# Altium schematic sheet USB.SchDoc
size A4; SheetNumber: 2; SheetTotal: 7
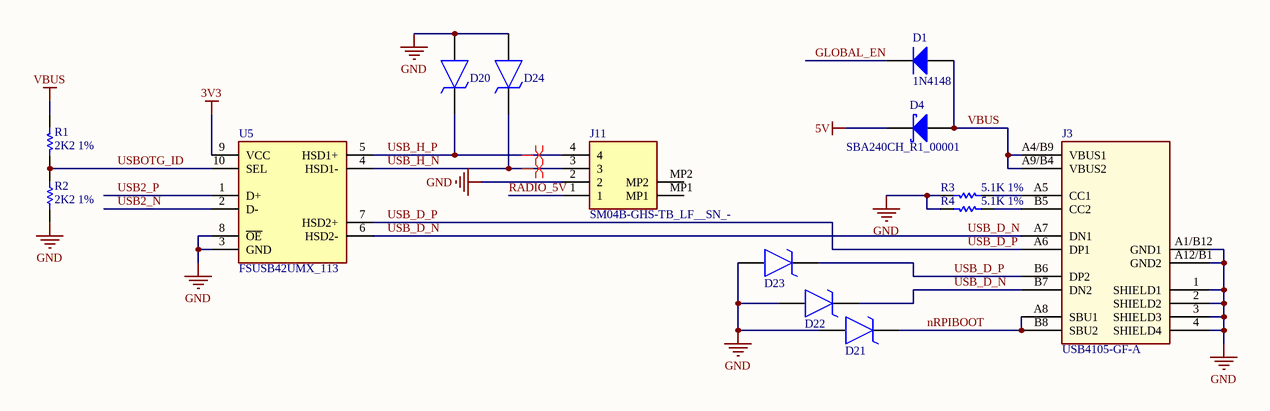
[diagram p0: USB.SchDoc]

## Parts
D1  1N4148  [SODFL1608X70N]
D4  SBA240CH_R1_00001  [SOD-323HE]
D20  ESD351DPYR  [UCLAMP2501TTCT]  (value not drawn)
D21  ESD351DPYR  [UCLAMP2501TTCT]  (value not drawn)
D22  ESD351DPYR  [UCLAMP2501TTCT]  (value not drawn)
D23  ESD351DPYR  [UCLAMP2501TTCT]  (value not drawn)
D24  ESD351DPYR  [UCLAMP2501TTCT]  (value not drawn)
J3  USB4105-GF-A  [GCT_USB4105]
J11  SM04B-GHS-TB_LF__SN_-  [SM04BGHSTBLFSN]
R1  2K2 1%  [0402]
R2  2K2 1%  [0402]
R3  5.1K 1%  [0402]
R4  5.1K 1%  [0402]
U5  FSUSB42UMX_113  [FSUSB42UMX_113]

## Nets
3V3: U5.9(VCC)
5V: D4.1(K)
GND: D20.1(A) D21.1(A) D22.1(A) D23.1(A) D24.1(A) J3.1(SHIELD1) J3.2(SHIELD2) J3.3(SHIELD3) J3.4(SHIELD4) J3.A1/B12(GND1) J3.A12/B1(GND2) J11.2 R2.2 R3.1 R4.1 U5.3(GND) U5.8(~{OE})
VBUS: D1.2(A) D4.2(A) J3.A4/B9(VBUS1) J3.A9/B4(VBUS2) R1.1
GLOBAL_EN: D1.1(K)
nRPIBOOT: D21.2(K) J3.A8(SBU1) J3.B8(SBU2)
RADIO_5V: J11.1
USB2_N: U5.2(D-)
USB2_P: U5.1(D+)
USB_D_N: D22.2(K) J3.A7(DN1) J3.B7(DN2) U5.6(HSD2-)
USB_D_P: D23.2(K) J3.A6(DP1) J3.B6(DP2) U5.7(HSD2+)
USB_H_N: D24.2(K) J11.3 U5.4(HSD1-)
USB_H_P: D20.2(K) J11.4 U5.5(HSD1+)
USBOTG_ID: R1.2 R2.1 U5.10(SEL)
NetJ3_A5: J3.A5(CC1) R3.2
NetJ3_B5: J3.B5(CC2) R4.2

Not connected (* = marked no-connect by the designer): J11 MP1 MP2

## Layout directives
differential pair; differential pair class USB: USB_H_N, USB_H_P

## Library data of the parts
D1 = Diode 1N4148: High Conductance Fast Diode; Manufacturer: Fairchild/ON Semiconductor; Manufacturer Part Number: 1N4148WT; Diode Type: Standard; Voltage - DC Reverse (Vr) (Max): 75V; Current - Average Rectified (Io): 200mA; Voltage - Forward (Vf) (Max) @ If: 1V @ 10mA; Speed: Small Signal =< 200mA (Io), Any Speed; Reverse Recovery Time (trr): 4ns; Current - Reverse Leakage @ Vr: 5µA @ 75V; Capacitance @ Vr, F: 5pF @ 0V, 1MHz; Supplier 1: Digi-Key; RoHS: RoHS Compliant; Category: Discrete Semiconductor Products; Stock 1: 120338; Pricing 1: 1=0.17, 10=0.158, 100=0.0858, 500=0.0528, 1000=0.036 (USD); Packaging: Cut Tape (CT); Part Status: Active; Mounting Type: Surface Mount; Package / Case: SC-79, SOD-523F; Supplier Device Package: SOD-523F; Operating Temperature - Junction: -55°C ~ 150°C; ComponentLink1URL: https://www.fairchildsemi.com/datasheets/1N/1N914BWT.pdf; ComponentLink1Description: https://www.fairchildsemi.com/datasheets/1N/1N914BWT.pdf; Supplier Part Number 1: 1N4148WTCT-ND; MountType: SMT; Height: 0.7mm
D4 = Diode SBA240CH_R1_00001: Diode Schottky 40V 2A SOD323HE; Manufacturer: Pan Jit; Supplier: Digikey; Supplier Part Number: 3757-SBA240CH_R1_00001CT-ND; Manufacturer Part Number: SBA240CH_R1_00001; RoHS: Yes; Category: Uncategorized; Stock: 27422; Pricing: 1=0.29, 10=0.18, 100=0.1122, 500=0.08274, 1000=0.0732, 2000=0.06515, 5000=0.0564, 10000=0.05099, 15000=0.04823, 25000=0.04513, 35000=0.04329, 50000=0.0415, 125000=0.03758, 250000=0.036 (USD); RoHS Compliant: Yes; Supplier 1: Digikey; Supplier Part Number 1: 3757-SBA240CH_R1_00001CT-ND
D20-D24 = ESD351DPYR: 1-channel 30 k-V ESD protection diode with low clamping -Voltage in 0402 Package 2-X1SON -40 to 125; Manufacturer: Texas Instruments; Direction: 210Direction; Interface: 224Interface; Value: 1.8pF; Height: 450um; Supplier: Mouser; Supplier Part Number: 595-ESD351DPYR; Manufacturer Part Number: ESD351DPYR; RoHS: Yes; Category: ESD and Circuit Protection ICs; Stock: 138971; Pricing: 1=0.27, 10=0.183, 50=0.183, 100=0.078, 1000=0.07, 10000=0.068 (USD); Pins: 2NUMBER; ComponentLink1URL: http://www.ti.com/lit/ds/symlink/esd351.pdf?src-supplier=Digikey; ComponentLink1Description: http://www.ti.com/lit/ds/symlink/esd351.pdf?src-supplier=Digikey; Supplier 1: Mouser; Supplier Part Number 1: 595-ESD351DPYR; Length: 600um; Width: 1mm; Thickness: 370um; ComponentLink2URL: http://www.ti.com/general/docs/suppproductinfo.tsp?distId=10&amp;gotoUrl=http%3A%2F%2Fwww.ti.com%2Flit%2Fgpn%2Fesd351&src-supplier=Digikey; ComponentLink2Description: http://www.ti.com/general/docs/suppproductinfo.tsp?distId=10&amp;gotoUrl=http%3A%2F%2Fwww.ti.com%2Flit%2Fgpn%2Fesd351&src-supplier=Digikey
J3 = USB4105-GF-A: CONN, RCPT, USB 2.0 TYPE C, R/A, SMD, 0.25A/1.25A/5A/6.25A, 24PIN; Manufacturer: GCT; Positions: 24; Voltage: 20VDC; Populate: *; Type: Connectors, Interconnects; Category: USB, DVI, HDMI; Status: Production; Revision: A; Operating Temperature: -40C to 85C; RoHS: YES; Connector Type: RCPT; Pitch: -; Current: 0.25A/1.25A/5A/6.25A; Number of Rows: 1ROW; Mounting Type: SMD; Orientation: R/A; Notes: -; Manufacturer Part Number: USB4105-GF-A; Supplier 1: Digikey; Supplier Part Number 1: 2073-USB4105-GF-ACT-ND
J11 = SM04B-GHS-TB_LF__SN_-: Conn Shrouded Header (4 Sides) HDR 4 POS 1.25mm Solder RA Side Entry SMD T/R; Manufacturer_Name: JST (JAPAN SOLDERLESS TERMINALS); Manufacturer_Part_Number: SM04B-GHS-TB(LF)(SN)-; Manufacturer: JST; Manufacturer Part Number: SM04B-GHS-TB(LF)(SN); Connector Type: 5775,5781ConnectorType; Datasheet Link: http://www.jst-mfg.com/product/pdf/eng/eGH.pdf; Height: 4.35mm; Arrow Part Number: SM04B-GHS-TB(LF)(SN)-; Arrow Price/Stock: https://www.arrow.com/en/products/sm04b-ghs-tb-lf-sn-/jst-manufacturing; Supplier: Mouser; Supplier Part Number: 306-SM04BGHSTBLFSN; RoHS: Yes; Category: Headers and Wire Housings; Stock: 2464; Pricing: 1=0.48, 10=0.39, 50=0.39, 100=0.311, 1000=0.231, 10000=0.168 (USD); Housing Material: 4261ConductorMaterial; Color: 50Colour; Housing Color: 50Colour; Packaging: 13Packaging; Fastening Type: 192,195FasteningType; Lead Free: 5697LeadFree; ComponentLink1URL: https://datasheet.ciiva.com/25617/0900766b810cef18-25617294.pdf?src-supplier=Rs; ComponentLink1Description: https://datasheet.ciiva.com/25617/0900766b810cef18-25617294.pdf?src-supplier=Rs; ComponentLink2URL: https://datasheet.ciiva.com/8052/5438-8052266.pdf?src-supplier=Element14; ComponentLink2Description: https://datasheet.ciiva.com/8052/5438-8052266.pdf?src-supplier=Element14; Supplier 1: Mouser; Supplier Part Number 1: 306-SM04BGHSTBLFSN
R1 R2 = Res_2K2_0402: SMD Chip Resistor, 2.2 kOhm, ± 1%, 63 mW, 0402 [1005 Metric], Thick Film, Anti-Sulfur; Manufacturer: Yageo; Manufacturer Part Number: AF0402FR-072K2L; Temperature Coefficient: 100ppm/°C; Value: 2.2kR; Max Power Dissipation: 63mW; Voltage Rating: 50V; Supplier 1: Mouser; RoHS: Yes; Category: Chip SMD Resistors; Packaging: Tape and Reel; Tolerance: 1%; Number of Terminations: 2; ComponentLink1URL: http://www.yageo.com/documents/recent/PYu-AF_51_RoHS_L_5.pdf?src-supplier=Digikey; ComponentLink1Description: http://www.yageo.com/documents/recent/PYu-AF_51_RoHS_L_5.pdf?src-supplier=Digikey; Supplier Part Number 1: 603-AF0402FR-072K2L; Supplier: Mouser; Supplier Part Number: 603-AF0402FR-072K2L; Stock: 30667; Pricing: 1=0.1, 10=0.017, 50=0.017, 100=0.014, 1000=0.011, 10000=0.005 (USD); Case/Package: 0402; Min Operating Temperature: -55°C; Max Operating Temperature: 155°C; Series: AF; RoHS Compliant: Yes; Features: Moisture Resistant,Anti-Sulfur; Length: 0.039inch; Width: 0.02inch; Height: 0.015inch
R3 R4 = Res_5.1K_0402: Res Thick Film 0402 5.1K Ohm 1% 0.063W(1/16W) ±100ppm/C Sulfur Resistant Molded SMD Automotive Paper T/R; Manufacturer: Yageo; Manufacturer Part Number: AC0402FR-075K1L; Resistance: 5.1kR; Power Rating: 63mW; Temperature Coefficient: 100ppm/°C; MountType: SMT; Supplier 1: Mouser; RoHS: Yes; Category: Chip SMD Resistors; Stock 1: 40112; Pricing 1: 1=0,10000, 10=0,01700, 100=0,00600, 1000=0,00500, 2500=0,00300, 10000=0,00300 (USD); Mount: Surface Mount; Case/Package: 0402; Case Code (Metric): 1005; Case Code (Imperial): 0402; Min Operating Temperature: -55°C; Max Operating Temperature: 155°C; Tolerance: 1%; Packaging: Tape and Reel; Composition: Thick Film; Number of Terminations: 2; Military Standard: Not; Max Power Dissipation: 63mW; Features: Moisture Resistant,Automotive AEC-Q200; Length: 0.039inch; Height: 0.015inch; Width: 0.02inch; Depth: 0.5mm; Lead Free: Lead Free; ComponentLink1URL: http://components.arrow.com/part/dataview/0323_03349107?src-supplier=Arrow+Europe; ComponentLink1Description: http://components.arrow.com/part/dataview/0323_03349107?src-supplier=Arrow+Europe; ComponentLink2URL: http://www.yageo.com/documents/recent/PYu-AC_51_RoHS_L_2_revised.pdf?src-supplier=Future+Electronics; ComponentLink2Description: http://www.yageo.com/documents/recent/PYu-AC_51_RoHS_L_2_revised.pdf?src-supplier=Future+Electronics; ComponentLink3URL: http://www.yageo.com/NewPortal/yageodocoutput?fileName=/pdf/R-Chip/PYu-AC_51_RoHS_L_6.pdf&src-supplier=Digi-Key; ComponentLink3Description: http://www.yageo.com/NewPortal/yageodocoutput?fileName=/pdf/R-Chip/PYu-AC_51_RoHS_L_6.pdf&src-supplier=Digi-Key; Supplier Part Number 1: 603-AC0402FR-075K1L
U5 = FSUSB42UMX_113: FSUSB42 Series DPDT 4.3 V 480 Mbps SMT Hi Speed USB 2.0 Switch - UMLP-10; Manufacturer_Name: onsemi; Manufacturer Lifecycle Status: ACTIVE; Description: USB Switch IC 1 Channel 10-UMLP (1.8x1.4),6.5Ohm,2.4V ~ 4.4V,	 -40C ~ 85C (TA).; -3db Bandwidth: 720MHz; Max Supply Voltage: 4.3V; Min Supply Voltage: 3V; Nominal Supply Current: 1µA; Number of Channels: 4; Number of Circuits: 1; Number of Inputs: 2; On-State Resistance: 6.5Ω; Operating Supply Voltage: 3.3V; Output Current: 100mA; Propagation Delay: 250ps; Value: 6.5Ω; Supply Type: Single; Turn-Off Delay Time: 25ns; Turn-On Delay Time: 30ns; Datasheet Link: https://www.onsemi.com/pdf/datasheet/fsusb42-d.pdf; Height: 0.55mm; Manufacturer_Part_Number: FSUSB42UMX_113; Supplier: Mouser; Supplier Part Number: 512-FSUSB42UMX; Manufacturer: onsemi; Manufacturer Part Number: FSUSB42UMX; RoHS: Compliant; Category: Analog Switches and Multiplexers; Stock: 30874; Pricing: 1=0.6, 1=0.516, 10=0.426, 10=0.366, 25=0.329, 50=0.382, 100=0.333, 100=0.286, 250=0.255, 1000=0.284, 1000=0.244, 2500=0.221, 5000=0.221, 10000=0.245, 10000=0.211 (USD); Ambient Temperature Range High: 85°C; Bandwidth: 720MHz; China RoHS: Compliant; Data Rate: 480Mbps; Height - Seated (Max): 550µm; Interface: USB; Lead Free: Lead Free; Length: 1.8mm; Lifecycle Status: Production; Max Operating Temperature: 85°C; Min Operating Temperature: -40°C; Mounting Technology: Surface Mount; Number of Outputs: 2; Pins: 10; Number of Ports: 2; Number of Terminals: 10; Radiation Hardening: No; REACH SVHC: Yes; Schedule B: 8542310000, 8542310000|8542310000, 8542310000|8542310000|8542310000, 8542310000|8542310000|8542310000|8542310000; Terminal Pitch: 400µm; Termination: SMD/SMT; Throw Configuration: DPDT; Weight: 18.08g; Width: 1.4mm; ComponentLink1URL: https://datasheet.octopart.com:443/FSUSB42UMX-onsemi-datasheet-180960821.pdf?src-supplier=IHS; ComponentLink1Description: https://datasheet.octopart.com:443/FSUSB42UMX-onsemi-datasheet-180960821.pdf?src-supplier=IHS; ComponentLink2URL: https://datasheet.octopart.com:443/FSUSB42UMX-Fairchild-Semiconductor-datasheet-45193007.pdf?src-supplier=IHS; ComponentLink2Description: https://datasheet.octopart.com:443/FSUSB42UMX-Fairchild-Semiconductor-datasheet-45193007.pdf?src-supplier=IHS; ComponentLink3URL: https://datasheet.octopart.com:443/FSUSB42UMX-ON-Semiconductor-datasheet-98394468.pdf?src-supplier=Master+Electronics; ComponentLink3Description: https://datasheet.octopart.com:443/FSUSB42UMX-ON-Semiconductor-datasheet-98394468.pdf?src-supplier=Master+Electronics; ComponentLink4URL: https://datasheet.octopart.com:443/FSUSB42UMX-onsemi-datasheet-189128738.pdf?src-supplier=Master+Electronics; ComponentLink4Description: https://datasheet.octopart.com:443/FSUSB42UMX-onsemi-datasheet-189128738.pdf?src-supplier=Master+Electronics; ComponentLink5URL: https://datasheet.octopart.com:443/FSUSB42UMX-ON-Semiconductor-datasheet-30896232.pdf?src-supplier=Upverter; ComponentLink5Description: https://datasheet.octopart.com:443/FSUSB42UMX-ON-Semiconductor-datasheet-30896232.pdf?src-supplier=Upverter; ComponentLink6URL: https://sigma.octopart.com:443/138898104/technical_drawing/ON-Semiconductor-FSUSB42UMX.pdf?src-supplier=Upverter; ComponentLink6Description: https://sigma.octopart.com:443/138898104/technical_drawing/ON-Semiconductor-FSUSB42UMX.pdf?src-supplier=Upverter; ComponentLink7URL: https://datasheet.octopart.com:443/FSUSB42UMX-ON-Semiconductor-datasheet-85551516.pdf?src-supplier=onsemi; ComponentLink7Description: https://datasheet.octopart.com:443/FSUSB42UMX-ON-Semiconductor-datasheet-85551516.pdf?src-supplier=onsemi; ComponentLink8URL: https://datasheet.octopart.com:443/FSUSB42UMX-ON-Semiconductor-datasheet-86697078.pdf?src-supplier=onsemi; ComponentLink8Description: https://datasheet.octopart.com:443/FSUSB42UMX-ON-Semiconductor-datasheet-86697078.pdf?src-supplier=onsemi; ComponentLink9URL: https://datasheet.octopart.com:443/FSUSB42UMX-Fairchild-datasheet-5415268.pdf?src-supplier=Fairchild+Semiconductor; ComponentLink9Description: https://datasheet.octopart.com:443/FSUSB42UMX-Fairchild-datasheet-5415268.pdf?src-supplier=Fairchild+Semiconductor; ComponentLink10URL: https://sigma.octopart.com:443/33085768/technical_drawing/Fairchild-Semiconductor-FSUSB42UMX.pdf?src-supplier=Fairchild+Semiconductor; ComponentLink10Description: https://sigma.octopart.com:443/33085768/technical_drawing/Fairchild-Semiconductor-FSUSB42UMX.pdf?src-supplier=Fairchild+Semiconductor; ComponentLink11URL: https://sigma.octopart.com:443/17345835/technical_drawing/Fairchild-Semiconductor-FSUSB42UMX.pdf?src-supplier=Fairchild+Semiconductor; ComponentLink11Description: https://sigma.octopart.com:443/17345835/technical_drawing/Fairchild-Semiconductor-FSUSB42UMX.pdf?src-supplier=Fairchild+Semiconductor; ComponentLink12URL: https://datasheet.octopart.com:443/FSUSB42UMX-onsemi-datasheet-175423455.pdf?src-supplier=element14+APAC; ComponentLink12Description: https://datasheet.octopart.com:443/FSUSB42UMX-onsemi-datasheet-175423455.pdf?src-supplier=element14+APAC; ComponentLink13URL: https://datasheet.octopart.com:443/FSUSB42UMX-ON-Semiconductor-datasheet-86690831.pdf?src-supplier=element14+APAC; ComponentLink13Description: https://datasheet.octopart.com:443/FSUSB42UMX-ON-Semiconductor-datasheet-86690831.pdf?src-supplier=element14+APAC; ComponentLink14URL: https://datasheet.octopart.com:443/FSUSB42UMX-Fairchild-Semiconductor-datasheet-9894994.pdf?src-supplier=Future+Electronics; ComponentLink14Description: https://datasheet.octopart.com:443/FSUSB42UMX-Fairchild-Semiconductor-datasheet-9894994.pdf?src-supplier=Future+Electronics; ComponentLink15URL: https://datasheet.octopart.com:443/FSUSB42UMX-Fairchild-datasheet-8326557.pdf?src-supplier=element14; ComponentLink15Description: https://datasheet.octopart.com:443/FSUSB42UMX-Fairchild-datasheet-8326557.pdf?src-supplier=element14; ComponentLink16URL: https://datasheet.octopart.com:443/FSUSB42UMX-onsemi-datasheet-164414351.pdf?src-supplier=Augswan; ComponentLink16Description: https://datasheet.octopart.com:443/FSUSB42UMX-onsemi-datasheet-164414351.pdf?src-supplier=Augswan; ComponentLink17URL: https://datasheet.octopart.com:443/FSUSB42UMX-Fairchild-datasheet-7537324.pdf?src-supplier=Farnell; ComponentLink17Description: https://datasheet.octopart.com:443/FSUSB42UMX-Fairchild-datasheet-7537324.pdf?src-supplier=Farnell; ComponentLink18URL: https://datasheet.octopart.com:443/FSUSB42UMX-Fairchild-datasheet-166954.pdf?src-supplier=Mouser; ComponentLink18Description: https://datasheet.octopart.com:443/FSUSB42UMX-Fairchild-datasheet-166954.pdf?src-supplier=Mouser; ComponentLink19URL: https://datasheet.octopart.com:443/FSUSB42UMX-ON-Semiconductor-datasheet-140570334.pdf?src-supplier=Arrow.cn; ComponentLink19Description: https://datasheet.octopart.com:443/FSUSB42UMX-ON-Semiconductor-datasheet-140570334.pdf?src-supplier=Arrow.cn; ComponentLink20URL: https://datasheet.octopart.com:443/FSUSB42UMX-Fairchild-Semiconductor-datasheet-11743582.pdf?src-supplier=Arrow+Electronics; ComponentLink20Description: https://datasheet.octopart.com:443/FSUSB42UMX-Fairchild-Semiconductor-datasheet-11743582.pdf?src-supplier=Arrow+Electronics; ComponentLink21URL: https://datasheet.octopart.com:443/FSUSB42UMX-Fairchild-Semiconductor-datasheet-14043571.pdf?src-supplier=iiiC; ComponentLink21Description: https://datasheet.octopart.com:443/FSUSB42UMX-Fairchild-Semiconductor-datasheet-14043571.pdf?src-supplier=iiiC; ComponentLink22URL: https://datasheet.octopart.com:443/FSUSB42UMX-Fairchild-Semiconductor-datasheet-21199434.pdf?src-supplier=Newark; ComponentLink22Description: https://datasheet.octopart.com:443/FSUSB42UMX-Fairchild-Semiconductor-datasheet-21199434.pdf?src-supplier=Newark; ComponentLink23URL: http://sigma.octopart.com:80/150611563/rohs_statement/ON-Semiconductor-FSUSB42UMX.pdf?src-supplier=Compliance+Statements; ComponentLink23Description: http://sigma.octopart.com:80/150611563/rohs_statement/ON-Semiconductor-FSUSB42UMX.pdf?src-supplier=Compliance+Statements; ComponentLink24URL: http://sigma.octopart.com:80/23428372/reach_statement/Fairchild-Semiconductor-FSUSB42UMX.pdf?src-supplier=Compliance+Statements; ComponentLink24Description: http://sigma.octopart.com:80/23428372/reach_statement/Fairchild-Semiconductor-FSUSB42UMX.pdf?src-supplier=Compliance+Statements; ComponentLink25URL: http://sigma.octopart.com:80/23428373/materials_sheet/Fairchild-Semiconductor-FSUSB42UMX.pdf?src-supplier=Compliance+Statements; ComponentLink25Description: http://sigma.octopart.com:80/23428373/materials_sheet/Fairchild-Semiconductor-FSUSB42UMX.pdf?src-supplier=Compliance+Statements; ComponentLink26URL: http://sigma.octopart.com:80/33177200/reach_statement/Fairchild-Semiconductor-FSUSB42UMX.pdf?src-supplier=Compliance+Statements; ComponentLink26Description: http://sigma.octopart.com:80/33177200/reach_statement/Fairchild-Semiconductor-FSUSB42UMX.pdf?src-supplier=Compliance+Statements; ComponentLink27URL: http://sigma.octopart.com:80/33177201/materials_sheet/Fairchild-Semiconductor-FSUSB42UMX.pdf?src-supplier=Compliance+Statements; ComponentLink27Description: http://sigma.octopart.com:80/33177201/materials_sheet/Fairchild-Semiconductor-FSUSB42UMX.pdf?src-supplier=Compliance+Statements; ComponentLink28URL: http://sigma.octopart.com:80/reach_statement/ON-Semiconductor-company-79.pdf?src-supplier=Compliance+Statements; ComponentLink28Description: http://sigma.octopart.com:80/reach_statement/ON-Semiconductor-company-79.pdf?src-supplier=Compliance+Statements; ComponentLink29URL: http://sigma.octopart.com:80/reach_statement/Fairchild-Semiconductor-company-9.pdf?src-supplier=Compliance+Statements; ComponentLink29Description: http://sigma.octopart.com:80/reach_statement/Fairchild-Semiconductor-company-9.pdf?src-supplier=Compliance+Statements; ComponentLink30URL: http://sigma.octopart.com:80/rohs_statement/Fairchild-Semiconductor-company-10.pdf?src-supplier=Compliance+Statements; ComponentLink30Description: http://sigma.octopart.com:80/rohs_statement/Fairchild-Semiconductor-company-10.pdf?src-supplier=Compliance+Statements; ComponentLink31URL: http://sigma.octopart.com:80/rohs_statement/Fairchild-Semiconductor-company-11.pdf?src-supplier=Compliance+Statements; ComponentLink31Description: http://sigma.octopart.com:80/rohs_statement/Fairchild-Semiconductor-company-11.pdf?src-supplier=Compliance+Statements; ComponentLink32URL: https://octopart.com:443/opatz8j6/c1?t=yJSfeKih65pKYlajCmlsqfJFHGz0OBXzEptnL3ZB3MlmGKhf8cAhbwDZIPd4jzaW62RYGboSm5psNiBc5YnoYD9siCb2AxUnvlKr7RDlfeJweDm-t6h9UyFuQM1A55i6H24IyfN-jo2kAa-Gz66hWb2ItleBZ_e7RngUOb9BcBGuiPyqcWPl1tXNqJ2fWx0L4sVcsa8D3j9bhg-hRc4oM-s8YEQ4LKS-o9uWRE8kytVckCDe8Eocd6SX23YpvP3sCno6n-92bIMQLqxbRwscFgDc3X6w5paVMU4iHG_lN7WW9tumZPfqTkoWD1UwdC7fjAAlNqsEDhDWGJq0UvY-qDtS_PsuBl3Sl4WFOOY&src-supplier=Compliance+Statements; ComponentLink32Description: https://octopart.com:443/opatz8j6/c1?t=yJSfeKih65pKYlajCmlsqfJFHGz0OBXzEptnL3ZB3MlmGKhf8cAhbwDZIPd4jzaW62RYGboSm5psNiBc5YnoYD9siCb2AxUnvlKr7RDlfeJweDm-t6h9UyFuQM1A55i6H24IyfN-jo2kAa-Gz66hWb2ItleBZ_e7RngUOb9BcBGuiPyqcWPl1tXNqJ2fWx0L4sVcsa8D3j9bhg-hRc4oM-s8YEQ4LKS-o9uWRE8kytVckCDe8Eocd6SX23YpvP3sCno6n-92bIMQLqxbRwscFgDc3X6w5paVMU4iHG_lN7WW9tumZPfqTkoWD1UwdC7fjAAlNqsEDhDWGJq0UvY-qDtS_PsuBl3Sl4WFOOY&src-supplier=Compliance+Statements; ComponentLink33URL: https://octopart.com:443/opatz8j6/c1?t=M-r_zt5wR6dC2HIhZLEte0grdrybbUcTbkn9TsZDNj8EgGtMy5cun7qoUF5pbqyphMQW7YHFvY98XVJBiX6rCk5q6f9m3Skx1adUByHfE9LuVHCPPGgxnQhc_8tmlEx2YPQGzvF-4xvrfI_M-yI_etScp8J77q-8EPr0zvKKeCvvIllfxKl74BTG3tp0wh4D0tnZLgKsN0DKCHGWGJ62laDadKUrwhnNgP9CUqAK9UDDN0Lf5ibflb0LPsQ-mThL6tRRUmJyCii_8ZPGx_RWwTNvOBKoCNnPQb9QGzFFoNn2_g3u5xIoiZwu3msI5DKxwrdMQ9203SWocX8CX_Nku_PqFgUV49Qp3tNW2zr3&src-supplier=Compliance+Statements; ComponentLink33Description: https://octopart.com:443/opatz8j6/c1?t=M-r_zt5wR6dC2HIhZLEte0grdrybbUcTbkn9TsZDNj8EgGtMy5cun7qoUF5pbqyphMQW7YHFvY98XVJBiX6rCk5q6f9m3Skx1adUByHfE9LuVHCPPGgxnQhc_8tmlEx2YPQGzvF-4xvrfI_M-yI_etScp8J77q-8EPr0zvKKeCvvIllfxKl74BTG3tp0wh4D0tnZLgKsN0DKCHGWGJ62laDadKUrwhnNgP9CUqAK9UDDN0Lf5ibflb0LPsQ-mThL6tRRUmJyCii_8ZPGx_RWwTNvOBKoCNnPQb9QGzFFoNn2_g3u5xIoiZwu3msI5DKxwrdMQ9203SWocX8CX_Nku_PqFgUV49Qp3tNW2zr3&src-supplier=Compliance+Statements; Supplier 1: Mouser; Supplier Part Number 1: 512-FSUSB42UMX